# EAGLE design Pogramador_FT230XQ (EAGLE 6.2)
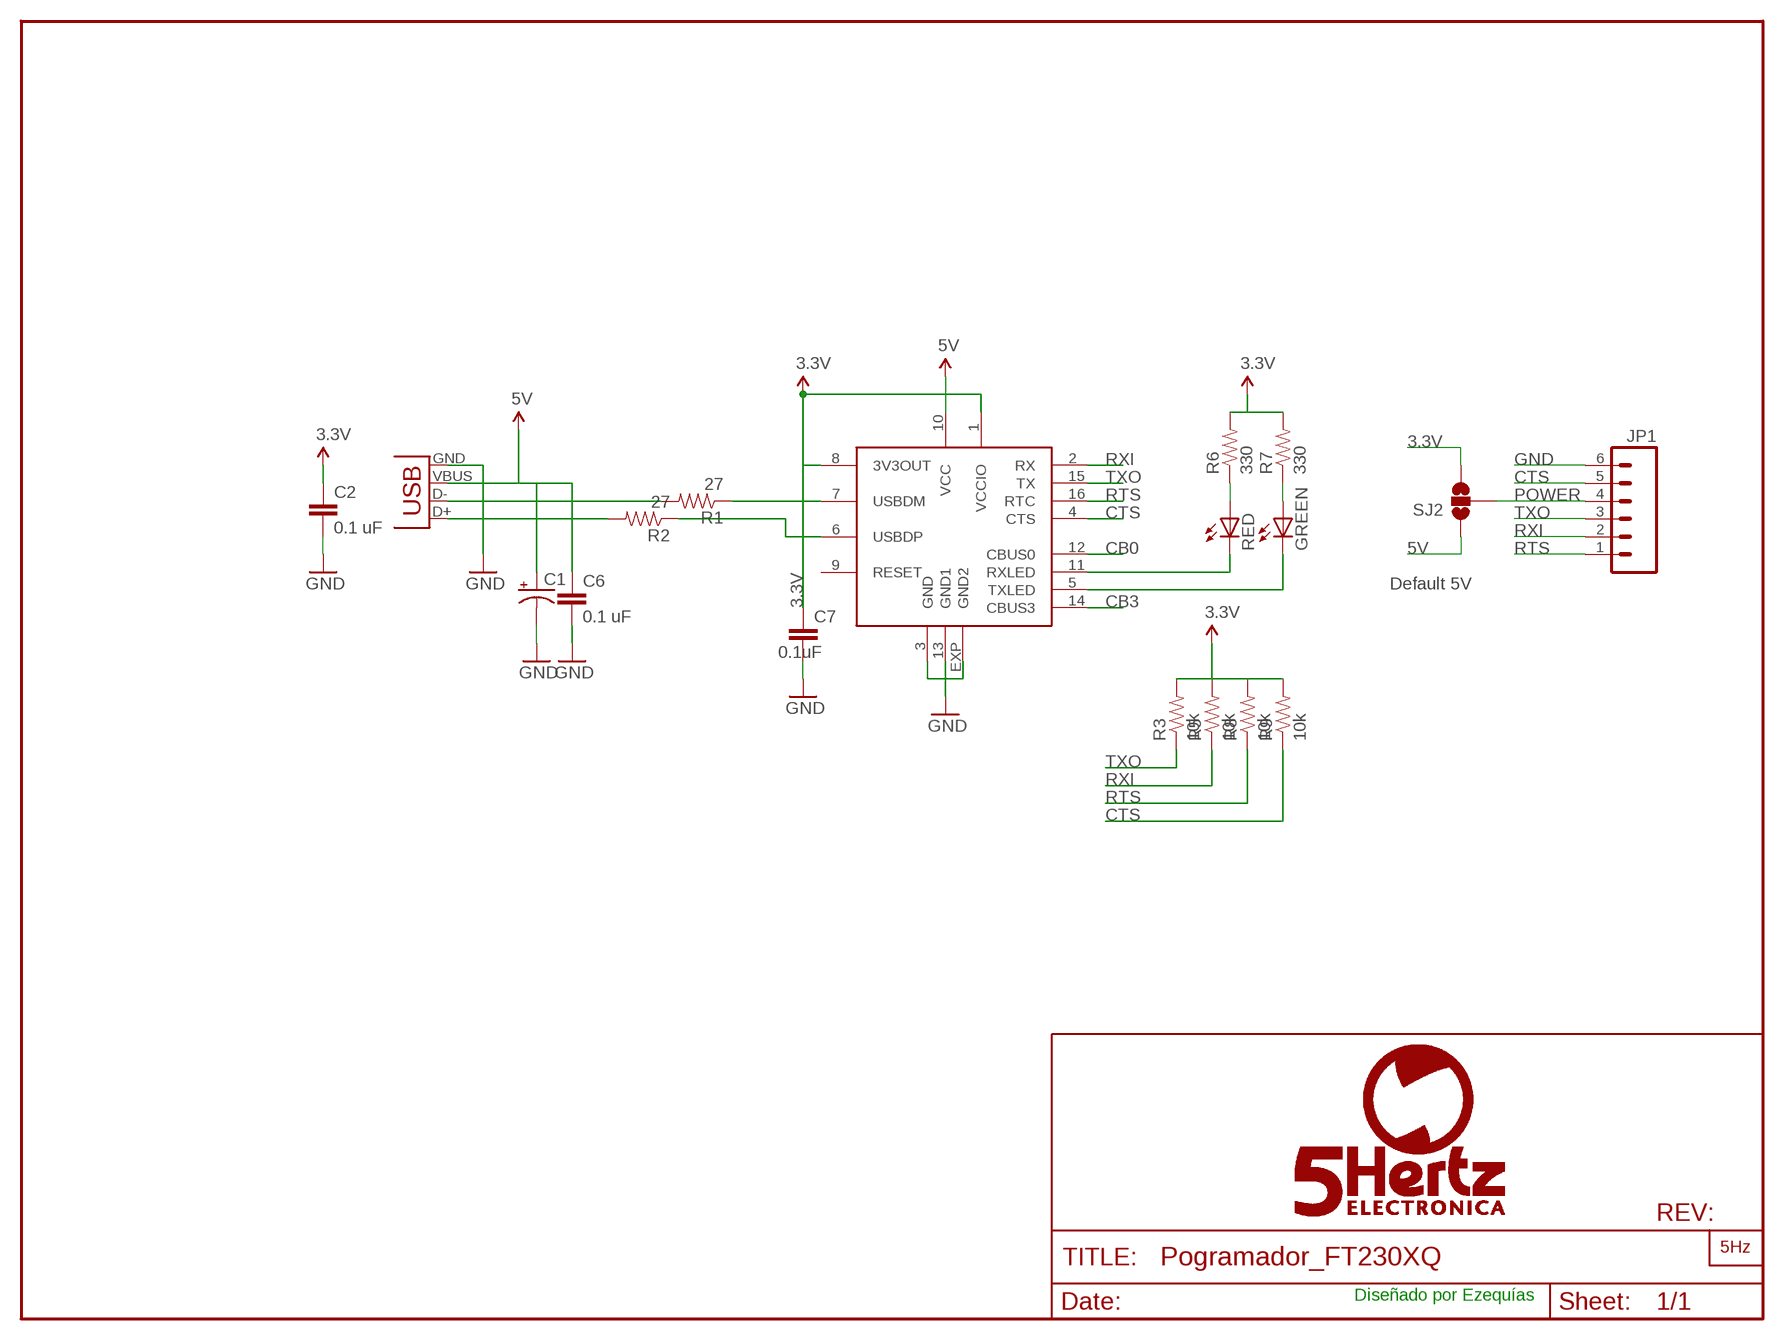
[diagram p0: schematic, sheet 1]

## Parts
C1  CAP_POL1206  [EIA3216]
C2  0.1 uF  CAP0603-CAP  [0603-CAP]
C6  0.1 uF  CAP0603-CAP  [0603-CAP]
C7  0.1uF  CAP0603-CAP  [0603-CAP]
GREEN  LED0603  [LED-0603]
JP1  M06SIP  [1X06]
R1  27  RESISTOR0603-RES  [0603-RES]
R2  27  RESISTOR0603-RES  [0603-RES]
R3  10k  RESISTOR0603-RES  [0603-RES]
R5  10k  RESISTOR0603-RES  [0603-RES]
R6  330  RESISTOR0603-RES  [0603-RES]
R7  330  RESISTOR0603-RES  [0603-RES]
R8  10k  RESISTOR0603-RES  [0603-RES]
R9  10k  RESISTOR0603-RES  [0603-RES]
RED  LED0603  [LED-0603]
SJ2  SOLDERJUMPER_2WAYS  [SJ_3]
U$2  LOGO2_SILKL5MM  [LARGO2_5MM]
U$5  FT230  [QFN-16]
X1  USBSMD  [USB-MINIB]

## Nets
3.3V [power]: C2.1 C7.1 R3.2 R5.2 R6.2 R7.2 R8.2 R9.2 SJ2.3 U$5.1(VCCIO) U$5.8(3V3OUT)
5V [power]: C1.A(+) C6.1 SJ2.1 U$5.10(VCC) X1.VBUS
CB0: U$5.12(CBUS0)
CB3: U$5.14(CBUS3)
CTS: JP1.5 R9.1 U$5.4(CTS)
GND [power]: C1.C(-) C2.2 C6.2 C7.2 JP1.6 U$5.3(GND) U$5.13(GND1) U$5.EXP(GND2) X1.GND
N$1: R2.1 U$5.6(USBDP)
N$3: R1.1 U$5.7(USBDM)
N$5: R1.2 X1.D-
N$6: R2.2 X1.D+
N$8: GREEN.A R7.1
N$9: R6.1 RED.A
N$10: RED.C U$5.11(RXLED)
N$11: GREEN.C U$5.5(TXLED)
POWER: JP1.4 SJ2.2
RTS: JP1.1 R8.1 U$5.16(RTC)
RXI: JP1.2 R5.1 U$5.2(RX)
TXO: JP1.3 R3.1 U$5.15(TX)
Unconnected: U$5.9(RESET)

## Notes on the sheet
- Default 5V
- Diseñado por Ezequías

## Library data of the parts
C1 = SparkFun:CAP_POL: Capacitor Polarized These are standard SMD and PTH capacitors. Normally 10uF, 47uF, and 100uF in electrolytic and tantalum varieties. Always verify the external diameter of the through hole cap, it varies with capacity, voltage, and manufacturer. The EIA devices should be standard.
C2 C6 C7 = SparkFun:CAP: Capacitor Standard 0603 ceramic capacitor, and 0.1" leaded capacitor.
GREEN RED = SparkFun:LED: LEDs Standard schematic elements and footprints for 5mm, 3mm, 1206, and 0603 sized LEDs. 5mm - Spark Fun Electronics SKU : COM-00529 (and others)
JP1 = SparkFun:M06: Header 6 Standard 6-pin 0.1" header. Use with straight break away headers (SKU : PRT-00116), right angle break away headers (PRT-00553), swiss pins (PRT-00743), machine pins (PRT-00117), and female headers (PRT-00115). Molex polarized connector foot print use with SKU : PRT-08094 with associated crimp pins and housings. NOTES ON THE VARIANTS LOCK and LOCK_LONGPADS... This footprint was designed to help hold the alignment of a through-hole component (i.e. 6-pin header) while soldering it into place. You may notice that each hole has been shifted either up or down by 0.005 of an inch from it's more standard position (which is a perfectly straight line). This slight alteration caused the pins (the squares in the middle) to touch the edges of the holes. Because they are alternating, it causes a "brace" to hold the component in place. 0.005 has proven to be the perfect amount of "off-center" position when using our standard breakaway headers. Although looks a little odd when you look at the bare footprint, once you have a header in there, the alteration is very hard to notice. Also, if you push a header all the way into place, it is covered up entirely on the bottom side. This idea of altering the position of holes to aid alignment will be further integrated into the Sparkfun Library for other footprints. It can help hold any component with 3 or more connection pins.
R1-R3 R5-R9 = SparkFun:RESISTOR: Resistor Basic schematic elements and footprints for 0603, 1206, and PTH resistors.
SJ2 = SparkFun:SOLDERJUMPER_2WAY: Solder Jumper 2 way solder jumper
U$2 = LOGO:LOGO2_SILK: PRINCIPAL
U$5 = FT230:FT230
X1 = SparkFun:USB: USB Connectors USB-B-PTH is fully proven SKU : PRT-00139 USB-miniB is fully proven SKU : PRT-00587 USB-A-PCB is untested. USB-A-H is throughly reviewed, but untested. Spark Fun Electronics SKU : PRT-00437 USB-B-SMT is throughly reviewed, but untested. Needs silkscreen touching up. USB-A-S has not been used/tested USB-MB-H has not been used/tested

## Net classes
0 default: width 0.203 mm
1 power: width 0.254 mm

## Board
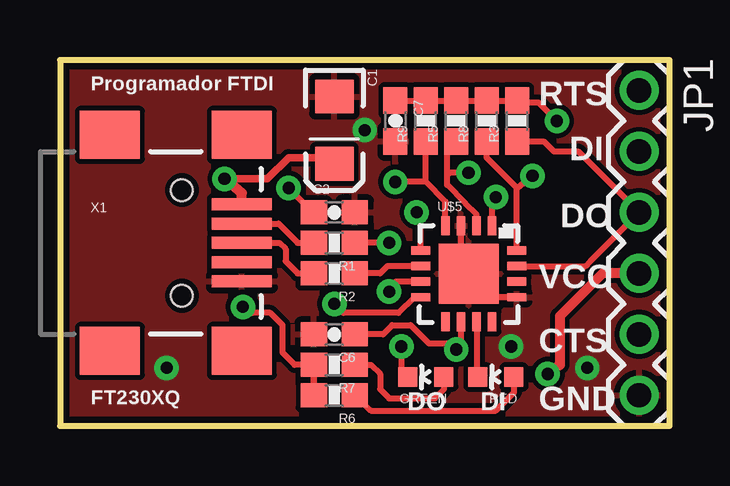
[diagram p1: board, top side]
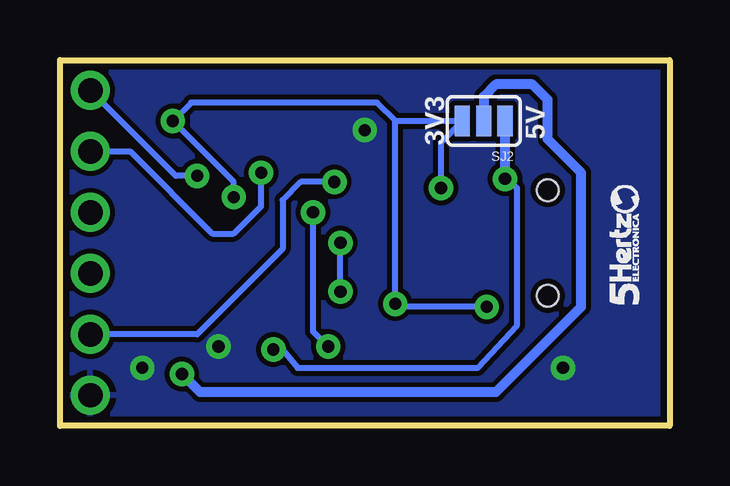
[diagram p2: board, bottom side, seen from below]

Size 25.4 x 15.24 mm. Coordinates in mm from the lower left corner, seen from the top.
Outline: 0,0 25.4,0 25.4,15.24 0,15.24 0,0
Copper layers (1*16): Top 0.035mm / dielectric 1.5mm / Bottom 0.035mm
Design rules: minimum track width 8mil, minimum drill 20mil, track to track 8mil, track to pad 8mil, pad to pad 8mil, via to via 8mil, smd to smd 8mil, copper to edge 10mil, drill to drill 8mil, minimum pad ring 12mil, minimum via ring 10mil, stop-mask expansion 4mil, vias tented up to drill 25mil, thermal gap 10mil

### Footprints (pad centres in the part's own frame; a part is rotated, then mirrored left to right if it is on the bottom)
EIA3216 = smd 1.4 x 1.6: A 1.4,0; C -1.4,0
0603-CAP = smd 1.1 x 1: 1 -0.85,0; 2 0.85,0
LED-0603 = smd 0.8 x 0.8: A 0,-0.75; C 0,0.75
1X06 = drill 1.016: 1 0,0; 2 2.54,0; 3 5.08,0; 4 7.62,0; 5 10.16,0; 6 12.7,0
0603-RES = smd 1.1 x 1: 1 -0.85,0; 2 0.85,0
SJ_3 = smd 0.635 x 1.27: 1 -0.889,0; 2 0,0; 3 0.889,0
QFN-16 = smd 0.8 x 0.35: 1 1.981,-0.989; 2 1.981,-0.339; 3 1.981,0.311; 4 1.981,0.961; 9 -2.019,0.961; 10 -2.019,0.311; 11 -2.019,-0.339; 12 -2.019,-0.989 | smd 0.35 x 0.8: 5 0.956,1.986; 6 0.306,1.986; 7 -0.344,1.986; 8 -0.994,1.986; 13 -0.994,-2.014; 14 -0.344,-2.014; 15 0.306,-2.014; 16 0.956,-2.014 | smd 2.5 x 2.5: EXP -0.019,-0.014
USB-MINIB = smd 2.5 x 0.5: D+ 2.5,0; D- 2.5,0.8; GND 2.5,-1.6; ID 2.5,-0.8; VBUS 2.5,1.6 | smd 2.5 x 2: MTN1 -3,4.5; MTN2 2.5,4.5; MTN3 -3,-4.5; MTN4 2.5,-4.5 | hole 0.9: 0,2.2; 0,-2.2

### Placement (x,y rotation side)
C1  11.43,12.32 270 top
C2  11.43,8.89 0 top
C6  11.43,3.81 180 top
C7  13.97,12.7 270 top
GREEN  15.24,2.03 90 top
JP1  24.13,13.97 270 top
R1  11.43,7.62 180 top
R2  11.43,6.35 180 top
R3  19.05,12.7 90 top
R5  16.51,12.7 90 top
R6  11.43,1.27 180 top
R7  11.43,2.54 180 top
R8  17.78,12.7 90 top
R9  15.24,12.7 90 top
RED  18.16,2.03 90 top
SJ2  7.75,12.7 180 bottom
U$2  1.27,5.08 90 bottom
U$5  17.02,6.35 90 top
X1  5.08,7.62 0 top

### Tracks (layer width: path | path; a pad name or v marks a point on that pad's centre or on a via)
3.3V  (via drill 0.51)
  Top 0.254: R6.2 R7.2 | R7.2 10.58,1.36 10.67,1.27 | v11.43,5.08 11.81,4.7 14.1,4.7 14.75,5.36 U$5.8 | v20.7,12.7 19.94,13.46 19.14,13.46 R3.2 C7.1 R9.2 R5.2 R8.2 | R7.2 10.58,1.31 10.54,1.27 | U$5.1 18.01,9.37 v18.16,9.53 | C2.1 10.54,8.89 v9.53,9.91 | R7.2 9.78,2.54 9.27,3.05 9.27,4.19 8.76,4.7 8,4.7 v7.62,4.95
  Bottom 0.254: 11.43,12.7 v11.43,5.08 11.3,4.95 v7.62,4.95 | v18.16,9.53 18.16,10.16 v20.7,12.7 19.94,13.46 12.19,13.46 11.43,12.7 | 11.43,12.7 SJ2.3 9.53,11.81 v9.53,9.91
5V  (via drill 0.51)
  Top 0.254: U$5.10 16.71,3.37 v16.51,3.17 16.26,3.43 15.37,3.43 14.61,4.19 13.84,4.19 13.46,3.81 C6.1
  Top 0.305: v6.86,10.29 8.64,10.29 9.53,11.18 11.17,11.18 C1.A
  Top 0.406: X1.VBUS 7.58,9.69 v6.86,10.29 | 11.18,10.67 C1.A
  Bottom 0.254: v16.51,3.17 16.13,3.17 15.49,2.41 8,2.41 6.35,4.19 6.35,9.91 v6.86,10.29
  Bottom 0.406: v6.86,10.29 SJ2.1
CTS  (via drill 0.51)
  Top 0.254: 16.06,9.34 U$5.4 16.06,9.34 | 16.06,9.34 15.24,10.16 | 15.24,10.16 R9.1 | 16.06,9.34 15.24,10.16 | 15.24,10.16 v13.97,10.16
  Bottom 0.254: v13.97,10.16 15.37,10.16 16.13,9.4 16.13,7.37 19.68,3.81 JP1.5
GND  (via drill 0.51)
  Top 0.254: U$5.13 18.01,5.36 U$5.EXP 16.71,6.66 U$5.3
  other vias: 21.97,2.41 4.45,2.41 12.7,12.32 18.8,3.3
  pour Top: 0,15.24 25.4,15.24 25.4,0 0,0
  pour Bottom: 0,15.24 25.4,15.24 25.4,0 0,0
N$1
  Top 0.254: U$5.6 13.64,6.66 13.34,6.35 R2.1
N$3  (via drill 0.51)
  Top 0.254: U$5.7 14.01,6.01 v13.72,5.59 | v13.72,7.62 R1.1
  Bottom 0.254: v13.72,5.59 v13.72,7.62
N$5
  Top 0.254: X1.D- 9.11,8.42 9.91,7.62 R1.2
N$6
  Top 0.254: X1.D+ 9.14,7.62 9.4,7.37 9.4,6.86 9.91,6.35 R2.2
N$8
  Top 0.254: 16,2.04 GREEN.A 16,2.02 16,1.52 15.62,1.14 13.72,1.14 13.34,1.52 13.34,2.16 12.95,2.54 R7.1
N$9
  Top 0.254: R6.1 12.32,1.27 12.95,0.64 18.16,0.64 18.92,1.4 18.92,2.02 RED.A
N$10
  Top 0.254: U$5.11 17.36,2.34 RED.C
N$11  (via drill 0.51)
  Top 0.254: U$5.5 15.03,8.72 v14.86,8.89 | v14.22,3.3 14.22,2.3 GREEN.C
  Bottom 0.254: v14.86,8.89 14.86,3.94 v14.22,3.3
POWER  (via drill 0.51)
  Top 0.406: JP1.4 22.61,6.35 20.83,4.57 20.83,2.54 v20.32,2.16
  Bottom 0.406: SJ2.2 7.75,13.72 7.24,14.22 5.71,14.22 5.08,13.59 5.08,11.94 3.68,10.54 3.68,4.95 7.24,1.4 19.56,1.4 v20.32,2.16
RTS  (via drill 0.51)
  Top 0.254: U$5.16 19.03,9.92 | 19.03,9.92 17.78,11.18 R8.1 | 19.03,9.92 19.07,9.92 v19.68,10.41
  Bottom 0.254: v19.68,10.41 20.57,10.41 JP1.1
RXI  (via drill 0.51)
  Top 0.254: 16.51,11.43 R5.1 16.13,11.47 16.13,10.54 | U$5.2 17.36,8.8 16.89,9.27 16.13,10.03 16.13,10.54 | v17.02,10.54 16.26,10.54 16.13,10.54
  Bottom 0.254: JP1.2 22.48,11.43 19.05,8 18.16,8 17.02,9.14 v17.02,10.54
TXO
  Top 0.254: U$5.15 19.36,6.66 21.9,6.66 22.1,6.86 JP1.3 21.59,11.43 20.57,11.43 20.15,11.85 R3.1

### Text on the board
tPlace: Programador FTDI | RTS | DI | DO | VCC | CTS | FT230XQ | DO | DI | GND
bPlace: 5V | 3V3